# EAGLE design lightBoard (EAGLE 6.4)
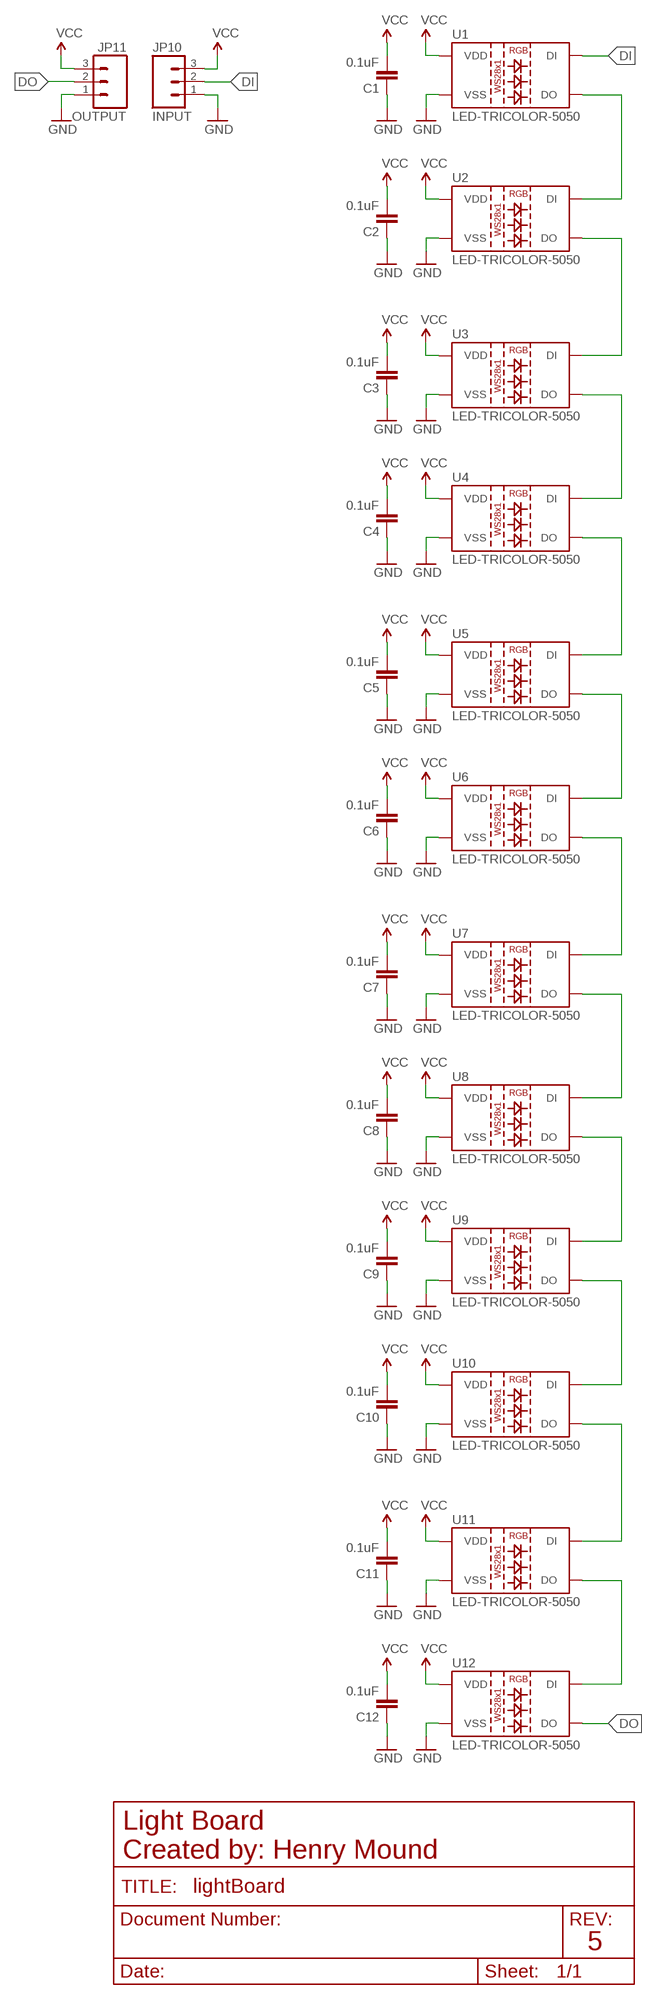
[diagram p0: schematic, sheet 1]

## Parts
C1  0.1uF  CAP0603-CAP  [0603-CAP]
C2  0.1uF  CAP0603-CAP  [0603-CAP]
C3  0.1uF  CAP0603-CAP  [0603-CAP]
C4  0.1uF  CAP0603-CAP  [0603-CAP]
C5  0.1uF  CAP0603-CAP  [0603-CAP]
C6  0.1uF  CAP0603-CAP  [0603-CAP]
C7  0.1uF  CAP0603-CAP  [0603-CAP]
C8  0.1uF  CAP0603-CAP  [0603-CAP]
C9  0.1uF  CAP0603-CAP  [0603-CAP]
C10  0.1uF  CAP0603-CAP  [0603-CAP]
C11  0.1uF  CAP0603-CAP  [0603-CAP]
C12  0.1uF  CAP0603-CAP  [0603-CAP]
JP10  INPUT  M03PTH  [1X03]
JP11  OUTPUT  M03PTH  [1X03]
U1  LED-TRICOLOR-5050  LED-TRICOLOR-5050-ICWS2811  [LED-TRICOLOR-5050-IC]
U2  LED-TRICOLOR-5050  LED-TRICOLOR-5050-ICWS2811  [LED-TRICOLOR-5050-IC]
U3  LED-TRICOLOR-5050  LED-TRICOLOR-5050-ICWS2811  [LED-TRICOLOR-5050-IC]
U4  LED-TRICOLOR-5050  LED-TRICOLOR-5050-ICWS2811  [LED-TRICOLOR-5050-IC]
U5  LED-TRICOLOR-5050  LED-TRICOLOR-5050-ICWS2811  [LED-TRICOLOR-5050-IC]
U6  LED-TRICOLOR-5050  LED-TRICOLOR-5050-ICWS2811  [LED-TRICOLOR-5050-IC]
U7  LED-TRICOLOR-5050  LED-TRICOLOR-5050-ICWS2811  [LED-TRICOLOR-5050-IC]
U8  LED-TRICOLOR-5050  LED-TRICOLOR-5050-ICWS2811  [LED-TRICOLOR-5050-IC]
U9  LED-TRICOLOR-5050  LED-TRICOLOR-5050-ICWS2811  [LED-TRICOLOR-5050-IC]
U10  LED-TRICOLOR-5050  LED-TRICOLOR-5050-ICWS2811  [LED-TRICOLOR-5050-IC]
U11  LED-TRICOLOR-5050  LED-TRICOLOR-5050-ICWS2811  [LED-TRICOLOR-5050-IC]
U12  LED-TRICOLOR-5050  LED-TRICOLOR-5050-ICWS2811  [LED-TRICOLOR-5050-IC]

## Nets
DI: JP10.2 U1.2(DI)
DO: JP11.2 U12.1(DO)
GND: C1.1 C2.1 C3.1 C4.1 C5.1 C6.1 C7.1 C8.1 C9.1 C10.1 C11.1 C12.1 JP10.1 JP11.1 U1.6(VSS) U2.6(VSS) U3.6(VSS) U4.6(VSS) U5.6(VSS) U6.6(VSS) U7.6(VSS) U8.6(VSS) U9.6(VSS) U10.6(VSS) U11.6(VSS) U12.6(VSS)
N$1: U1.1(DO) U2.2(DI)
N$2: U3.1(DO) U4.2(DI)
N$3: U2.1(DO) U3.2(DI)
N$4: U5.1(DO) U6.2(DI)
N$5: U7.1(DO) U8.2(DI)
N$6: U6.1(DO) U7.2(DI)
N$7: U9.1(DO) U10.2(DI)
N$8: U11.1(DO) U12.2(DI)
N$9: U10.1(DO) U11.2(DI)
N$10: U8.1(DO) U9.2(DI)
N$11: U4.1(DO) U5.2(DI)
VCC: C1.2 C2.2 C3.2 C4.2 C5.2 C6.2 C7.2 C8.2 C9.2 C10.2 C11.2 C12.2 JP10.3 JP11.3 U1.3(VDD) U1.5(VDD) U2.3(VDD) U2.5(VDD) U3.3(VDD) U3.5(VDD) U4.3(VDD) U4.5(VDD) U5.3(VDD) U5.5(VDD) U6.3(VDD) U6.5(VDD) U7.3(VDD) U7.5(VDD) U8.3(VDD) U8.5(VDD) U9.3(VDD) U9.5(VDD) U10.3(VDD) U10.5(VDD) U11.3(VDD) U11.5(VDD) U12.3(VDD) U12.5(VDD)

## Notes on the sheet
- Light Board
  Created by: Henry Mound
- 5

## Library data of the parts
C1-C12 = SparkFun:CAP: Capacitor Standard 0603 ceramic capacitor, and 0.1" leaded capacitor.
JP10 JP11 = SparkFun-Connectors:M03: Header 3 Standard 3-pin 0.1" header. Use with straight break away headers (SKU : PRT-00116), right angle break away headers (PRT-00553), swiss pins (PRT-00743), machine pins (PRT-00117), and female headers (PRT-00115). Molex polarized connector foot print use with SKU : PRT-08232 with associated crimp pins and housings.
U1-U12 = SparkFun-LED:LED-TRICOLOR-5050-IC: 5x5mm SMD LED with built-in controller IC.

## Board
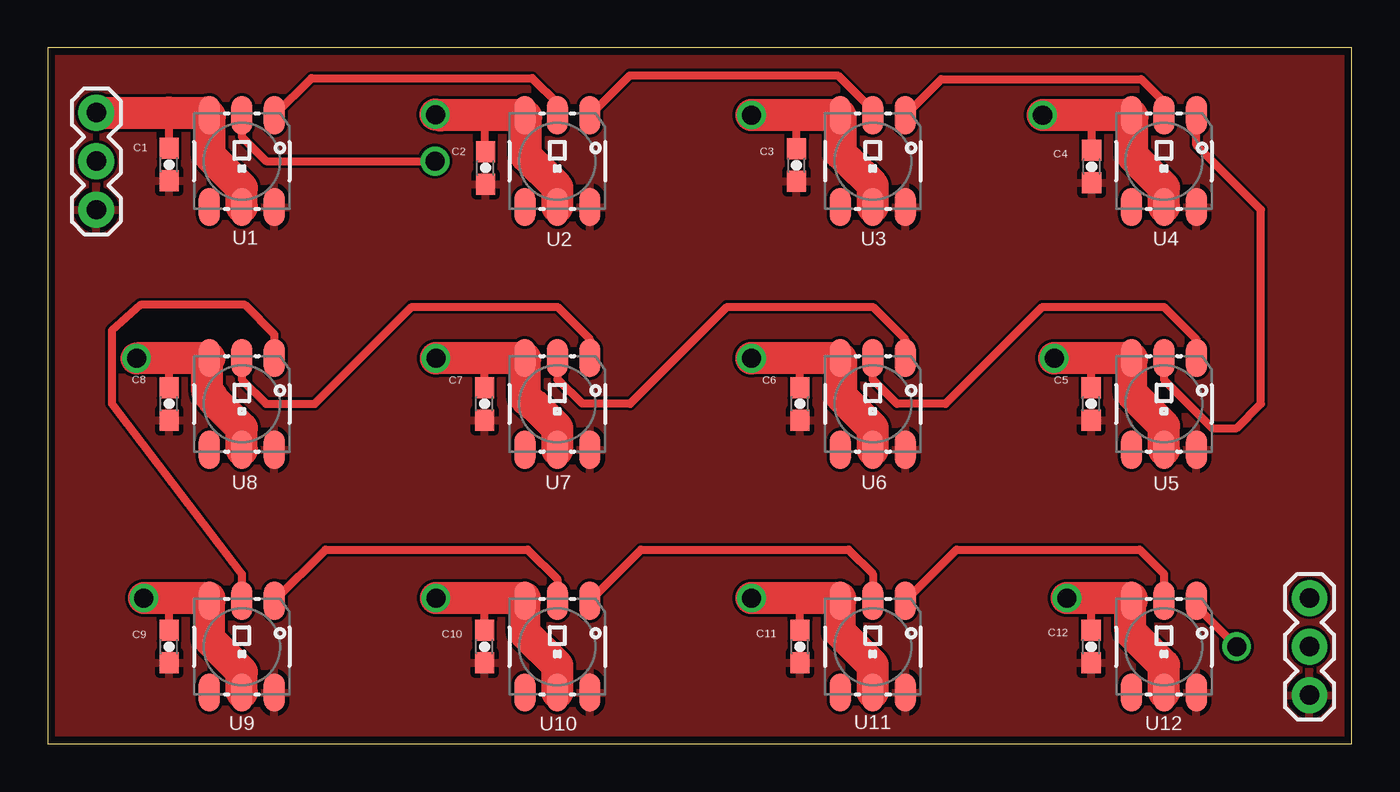
[diagram p1: board, top side]
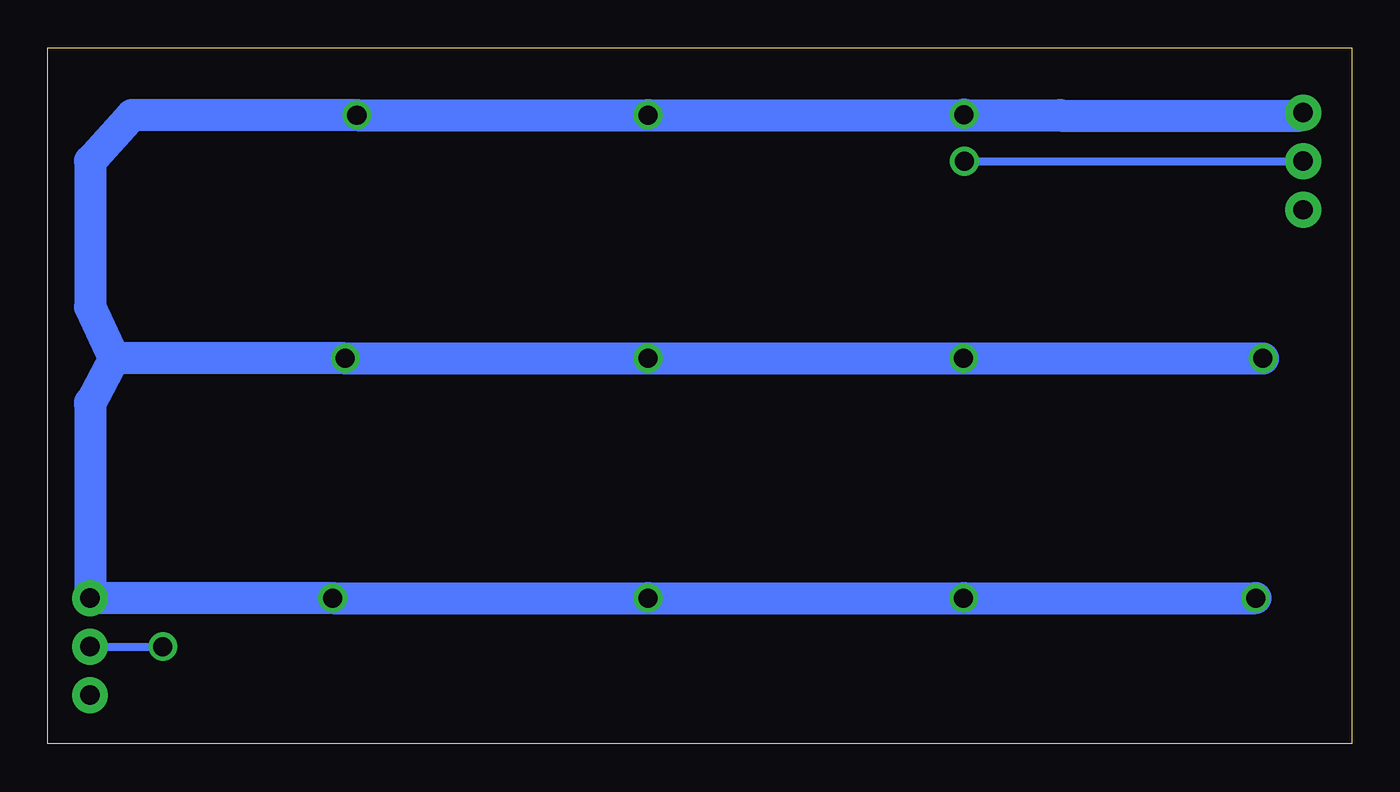
[diagram p2: board, bottom side, seen from below]

Size 68.25 x 36.41 mm. Coordinates in mm from the lower left corner, seen from the top.
Outline: 0,0 68.25,0 68.25,36.41 0,36.41 0,0
Copper layers (1*16): Top 0.0356mm / dielectric 1.5011mm / Bottom 0.0356mm
Design rules "LaenPCBOrder": minimum track width 6mil, minimum drill 13mil, track to track 6mil, track to pad 6mil, pad to pad 6mil, via to via 6mil, smd to smd 6mil, copper to edge 15mil, drill to drill 6mil, minimum pad ring 7mil, minimum via ring 7mil, stop-mask expansion 3mil, vias tented up to drill 0mil, thermal gap 10mil

### Footprints (pad centres in the part's own frame; a part is rotated, then mirrored left to right if it is on the bottom)
0603-CAP = smd 1.1 x 1: 1 -0.85,0; 2 0.85,0
1X03 = drill 1.016 pad 1.88: 1 0,0; 2 2.54,0; 3 5.08,0
LED-TRICOLOR-5050-IC = smd 2 x 1.1: 1 -2.4,1.7; 2 -2.4,0; 3 -2.4,-1.7; 4 2.4,-1.7; 5 2.4,0; 6 2.4,1.7

### Placement (x,y rotation side)
C1  6.35,30.3 90 top
C2  22.91,30.12 90 top
C3  39.19,30.28 90 top
C4  54.64,30.2 90 top
C5  54.61,17.78 90 top
C6  39.37,17.78 90 top
C7  22.86,17.78 90 top
C8  6.35,17.78 90 top
C9  6.35,5.08 90 top
C10  22.86,5.08 90 top
C11  39.37,5.08 90 top
C12  54.61,5.08 90 top
JP10  2.54,27.94 90 top
JP11  66.04,2.54 90 top
U1  10.16,30.48 270 top
U2  26.67,30.48 270 top
U3  43.18,30.48 270 top
U4  58.42,30.48 270 top
U5  58.42,17.78 270 top
U6  43.18,17.78 270 top
U7  26.67,17.78 270 top
U8  10.16,17.78 270 top
U9  10.16,5.08 270 top
U10  26.67,5.08 270 top
U11  43.18,5.08 270 top
U12  58.42,5.08 270 top

### Tracks (layer width: path | path; a pad name or v marks a point on that pad's centre or on a via)
DI  (via drill 1)
  Top 0.406: U1.2 10.16,31.75 11.43,30.48 v20.27,30.48
  Bottom 0.406: v20.27,30.48 JP10.2
DO  (via drill 1)
  Top 0.406: 60.12,7.62 U12.1 60.12,7.19 v62.23,5.08
  Bottom 0.406: JP11.2 v62.23,5.08
GND
  pour Top: 0,0 68.58,0 68.76,36.14 0.18,36.14
N$1
  Top 0.406: 26.67,33.02 U2.2 26.67,33.5 25.35,34.82 13.8,34.82 U1.1
N$2
  Top 0.406: U3.1 46.77,34.77 57.23,34.77 58.42,33.58 U4.2
N$3
  Top 0.406: U2.1 30.47,34.98 41.35,34.98 43.18,33.15 U3.2
N$4
  Top 0.406: U6.2 43.18,19.05 44.45,17.78 46.99,17.78 52.07,22.86 58.42,22.86 60.12,21.16 U5.1
N$5
  Top 0.406: U8.2 10.16,19.05 11.43,17.78 13.97,17.78 19.05,22.86 26.67,22.86 28.37,21.16 U7.1
N$6
  Top 0.406: U7.2 26.67,19.05 26.72,19.05 27.96,17.81 30.45,17.81 30.48,17.78 35.56,22.86 43.18,22.86 44.88,21.16 U6.1
N$7
  Top 0.406: U9.1 14.54,10.16 25.12,10.16 26.67,8.61 U10.2
N$8
  Top 0.406: U11.1 47.56,10.16 57.15,10.16 58.42,8.89 U12.2
N$9
  Top 0.406: U10.1 31.05,10.16 41.91,10.16 43.18,8.89 U11.2
N$10
  Top 0.406: U9.2 10.16,8.89 3.35,17.81 3.35,21.62 4.85,22.96 10.32,22.96 11.86,21.43 U8.1
N$11
  Top 0.406: U5.2 58.42,19.05 60.96,16.51 62.23,16.51 63.5,17.78 63.5,27.94 60.12,31.32 U4.1
VCC  (via drill 1)
  Top 0.406: C1.2 6.35,33.02 | C2.2 22.86,32.88 U2.3 | C4.2 54.63,32.87 54.61,32.89 | C3.2 39.19,32.72 39.37,32.89 | C8.2 6.35,20.18 U8.3 | C7.2 22.86,20.17 | 22.86,20.17 21.59,20.17 | 22.86,20.17 24.97,20.17 U7.3 | C6.2 39.37,20.17 41.48,20.17 U6.3 | C5.2 54.61,20.17 56.72,20.17 U5.3 | C9.2 6.35,7.52 8.46,7.52 U9.3 | C10.2 22.86,7.62 | C11.2 39.37,7.62 | C12.2 54.61,7.62
  Top 1.676: JP10.3 6.35,33.02 8.32,33.02 U1.3 8.48,32.86 8.48,30.76 10.16,29.08 U1.5 | v20.3,32.92 20.54,32.88 U2.3 25.04,32.81 25.04,30.73 26.67,29.11 U2.5 | v36.83,32.89 39.37,32.89 41.48,32.89 U3.3 41.5,32.86 41.5,30.86 41.88,30.48 41.91,30.48 43.18,29.21 U3.5 | v52.07,32.89 54.61,32.89 56.72,32.89 U4.3 56.77,32.83 56.77,30.76 58.42,29.11 U4.5 | U5.3 v52.68,20.18 v52.68,20.17 | v20.32,20.17 v20.32,20.18 U7.3 24.99,20.16 24.99,18.09 25.3,17.78 25.4,17.78 26.67,16.51 U7.5 | v36.83,20.17 v36.83,20.18 U6.3 41.53,20.13 41.53,18.16 43.18,16.51 U6.5 | U8.5 10.16,16.51 8.59,18.09 8.59,18.16 8.36,18.39 8.36,20.08 8.45,20.17 | 8.45,20.17 U8.3 | 56.74,20.16 U5.3 | 8.46,7.52 8.46,7.62 v5.03,7.62 | v20.32,7.62 22.86,7.62 24.97,7.62 U10.3 24.97,5.79 26.67,4.09 U10.5 | v53.34,7.62 54.61,7.62 56.72,7.62 U12.3 56.67,7.43 56.67,5.87 58.42,4.12 U12.5 | v36.83,7.62 39.37,7.62 41.48,7.62 U11.3 41.45,7.45 41.45,5.84 43.18,4.12 U11.5 | U9.5 10.16,3.76 8.46,5.46 U9.3 | U5.5 58.42,16.64 56.72,18.34 U5.3 | 8.45,20.17 v4.65,20.17
  Bottom 1.676: v20.3,32.92 15.24,32.87 | 15.24,32.87 2.69,32.87 JP10.3 | 15.24,32.87 15.26,32.89 v36.83,32.89 v52.07,32.89 63.84,32.89 66.04,30.48 66.04,22.86 64.77,20.17 | v4.65,20.17 v20.32,20.17 v36.83,20.17 v52.68,20.17 64.77,20.17 | v5.03,7.62 v20.32,7.62 v36.83,7.62 v53.34,7.62 JP11.3 66.04,17.78 | 66.04,17.85 66.04,17.78 | 64.77,20.17 66.04,17.78